# EAGLE schematic Veroboard for ckt designing (EAGLE 7.7.0)

## Sheet 1 of 2

## Sheet 2 of 2
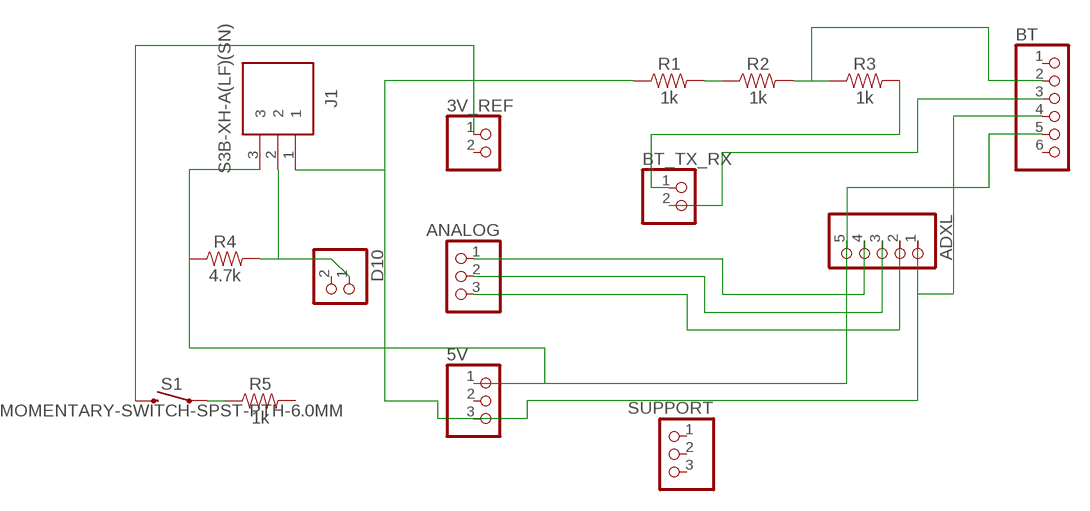
[diagram p0: schematic, sheet 2]

### Parts
3V_REF  PINHD-1X2  [1X02]
5V  PINHD-1X3  [1X03]
ADXL  PINHD-1X5  [1X05]
ANALOG  PINHD-1X3  [1X03]
BT  PINHD-1X6  [1X06]
BT_TX_RX  PINHD-1X2  [1X02]
D10  PINHD-1X2  [1X02]
J1  S3B-XH-A(LF)(SN)  [SHDR3W80P0X250_1X3_990X610X700]
R1  1k  1KOHM-HORIZ-1/4W-1%  [AXIAL-0.3]
R2  1k  1KOHM-HORIZ-1/4W-1%  [AXIAL-0.3]
R3  1k  1KOHM-HORIZ-1/4W-1%  [AXIAL-0.3]
R4  4.7k  1KOHM-HORIZ-1/4W-1%  [AXIAL-0.3]
R5  1k  1KOHM-HORIZ-1/4W-1%  [AXIAL-0.3]
S1  MOMENTARY-SWITCH-SPST-PTH-6.0MM  [TACTILE_SWITCH_PTH_6.0MM]
SUPPORT  PINHD-1X3  [1X03]

### Nets
3V: 3V_REF.1 S1.3
5V: 5V.1 ADXL.5 BT.5 J1.3 R4.P$1
BT_TX: BT.3 BT_TX_RX.2
G: 5V.3 ADXL.1 BT.4 J1.1 R1.P$1
N$1: R1.P$2 R2.P$1
N$2: BT.2 R2.P$2 R3.P$1
N$3: R5.P$1 S1.1
RX: BT_TX_RX.1 R3.P$2
TS: D10.1 J1.2 R4.P$2
X: ADXL.4 ANALOG.1
Y: ADXL.3 ANALOG.2
Z: ADXL.2 ANALOG.3
Unconnected: 3V_REF.2 5V.2 BT.1 BT.6 D10.2 R5.P$2 SUPPORT.1 SUPPORT.2 SUPPORT.3

## Library data of the parts
3V_REF BT_TX_RX D10 = pinhead:PINHD-1X2: PIN HEADER
5V ANALOG SUPPORT = pinhead:PINHD-1X3: PIN HEADER
ADXL = pinhead:PINHD-1X5: PIN HEADER
BT = pinhead:PINHD-1X6: PIN HEADER
J1 = SamacSys_Parts:S3B-XH-A(LF)(SN): XH-2.5mm Header side entry 3 way JST XH Series, Series Number S3B, 2.5mm Pitch 3 Way 1 Row Right Angle PCB Header, Solder Termination, 3A <https://componentsearchengine.com/Images/3/S3B-XH-A%28LF%29%28SN%29.jpg> Source: Datasheet <http://www.jst-mfg.com/product/pdf/eng/eXH.pdf>; DESCRIPTION: XH-2.5mm Header side entry 3 way JST XH Series, Series Number S3B, 2.5mm Pitch 3 Way 1 Row Right Angle PCB Header, Solder Termination, 3A; HEIGHT: 7mm; MANUFACTURER_NAME: JST (JAPAN SOLDERLESS TERMINALS); MANUFACTURER_PART_NUMBER: S3B-XH-A(LF)(SN); RS_PART_NUMBER: 8201585; SUPPLIER_NAME: RS
R1-R3 R5 = SparkFun-Resistors:1KOHM: 1kΩ resistor A resistor is a passive two-terminal electrical component that implements electrical resistance as a circuit element. Resistors act to reduce current flow, and, at the same time, act to lower voltage levels within circuits. - Wikipedia; PROD_ID: RES-12182
R4 = SparkFun-Resistors:1KOHM: 1kΩ resistor A resistor is a passive two-terminal electrical component that implements electrical resistance as a circuit element. Resistors act to reduce current flow, and, at the same time, act to lower voltage levels within circuits. - Wikipedia; PROD_ID: RES-12182; VALUE: 1k
S1 = SparkFun-Switches:MOMENTARY-SWITCH-SPST: Momentary Switch (Pushbutton) - SPST Normally-open (NO) SPST momentary switches (buttons, pushbuttons). Variants PTH-12MM - 12mm square, through-hole Momentary Pushbutton Switch - 12mm Square <https://www.sparkfun.com/products/9190> (COM-09190) PTH-6.0MM, PTH-6.0MM-KIT - 6.0mm square, through-hole Mini Pushbutton Switch <https://www.sparkfun.com/products/97> (COM-00097) KIT package intended for soldering kit's - only one side of pads' copper is exposed. PTH-RIGHT-ANGLE-KIT - Right-angle, through-hole Right Angle Tactile Button <https://www.sparkfun.com/products/10791> - Used on SparkFun BigTime Watch Kit <https://www.sparkfun.com/products/11734> SMD-12MM - 12mm square, surface-mount Tactile Button - SMD (12mm) <https://www.sparkfun.com/products/12993> (COM-12993) Used on SparkFun PicoBoard <https://www.sparkfun.com/products/11888> SMD-4.5MM - 4.5mm Square Trackball Switch Used on SparkFun Blackberry Trackballer Breakout <https://www.sparkfun.com/products/13169> SMD-4.6MMX2.8MM - 4.60mm x 2.80mm, surface mount Used on SparkFun SAMD21 Mini Breakout <https://www.sparkfun.com/products/13664> SMD-5.2MM, SMD-5.2-REDUNDANT - 5.2mm square, surface-mount Mini Pushbutton Switch - SMD <https://www.sparkfun.com/products/8720> (COM-08720) Used on Arduino Pro Mini <https://www.sparkfun.com/products/11114> REDUNDANT package connects both switch circuits together SMD-6.0X3.5MM - 6.0 x 3.5mm, surface mount Momentary Reset Switch SMD <https://www.sparkfun.com/products/8229> (COM-08229) SMD-6.2MM-TALL - 6.2mm square, surface mount Tactile Button - SMD (6mm) <https://www.sparkfun.com/products/12992> Used on SparkFun Digital Sandbox <https://www.sparkfun.com/products/12651> SMD-RIGHT-ANGLE - Right-angle, surface mount Used on SparkFun Block for Intel® Edison - Arduino <https://www.sparkfun.com/products/13036>; PROD_ID: SWCH-08441; SF_SKU: COM-00097